# Altium schematic sheet top.SchDoc
size 420 x 297 mm; SheetNumber: 1; SheetTotal: 1
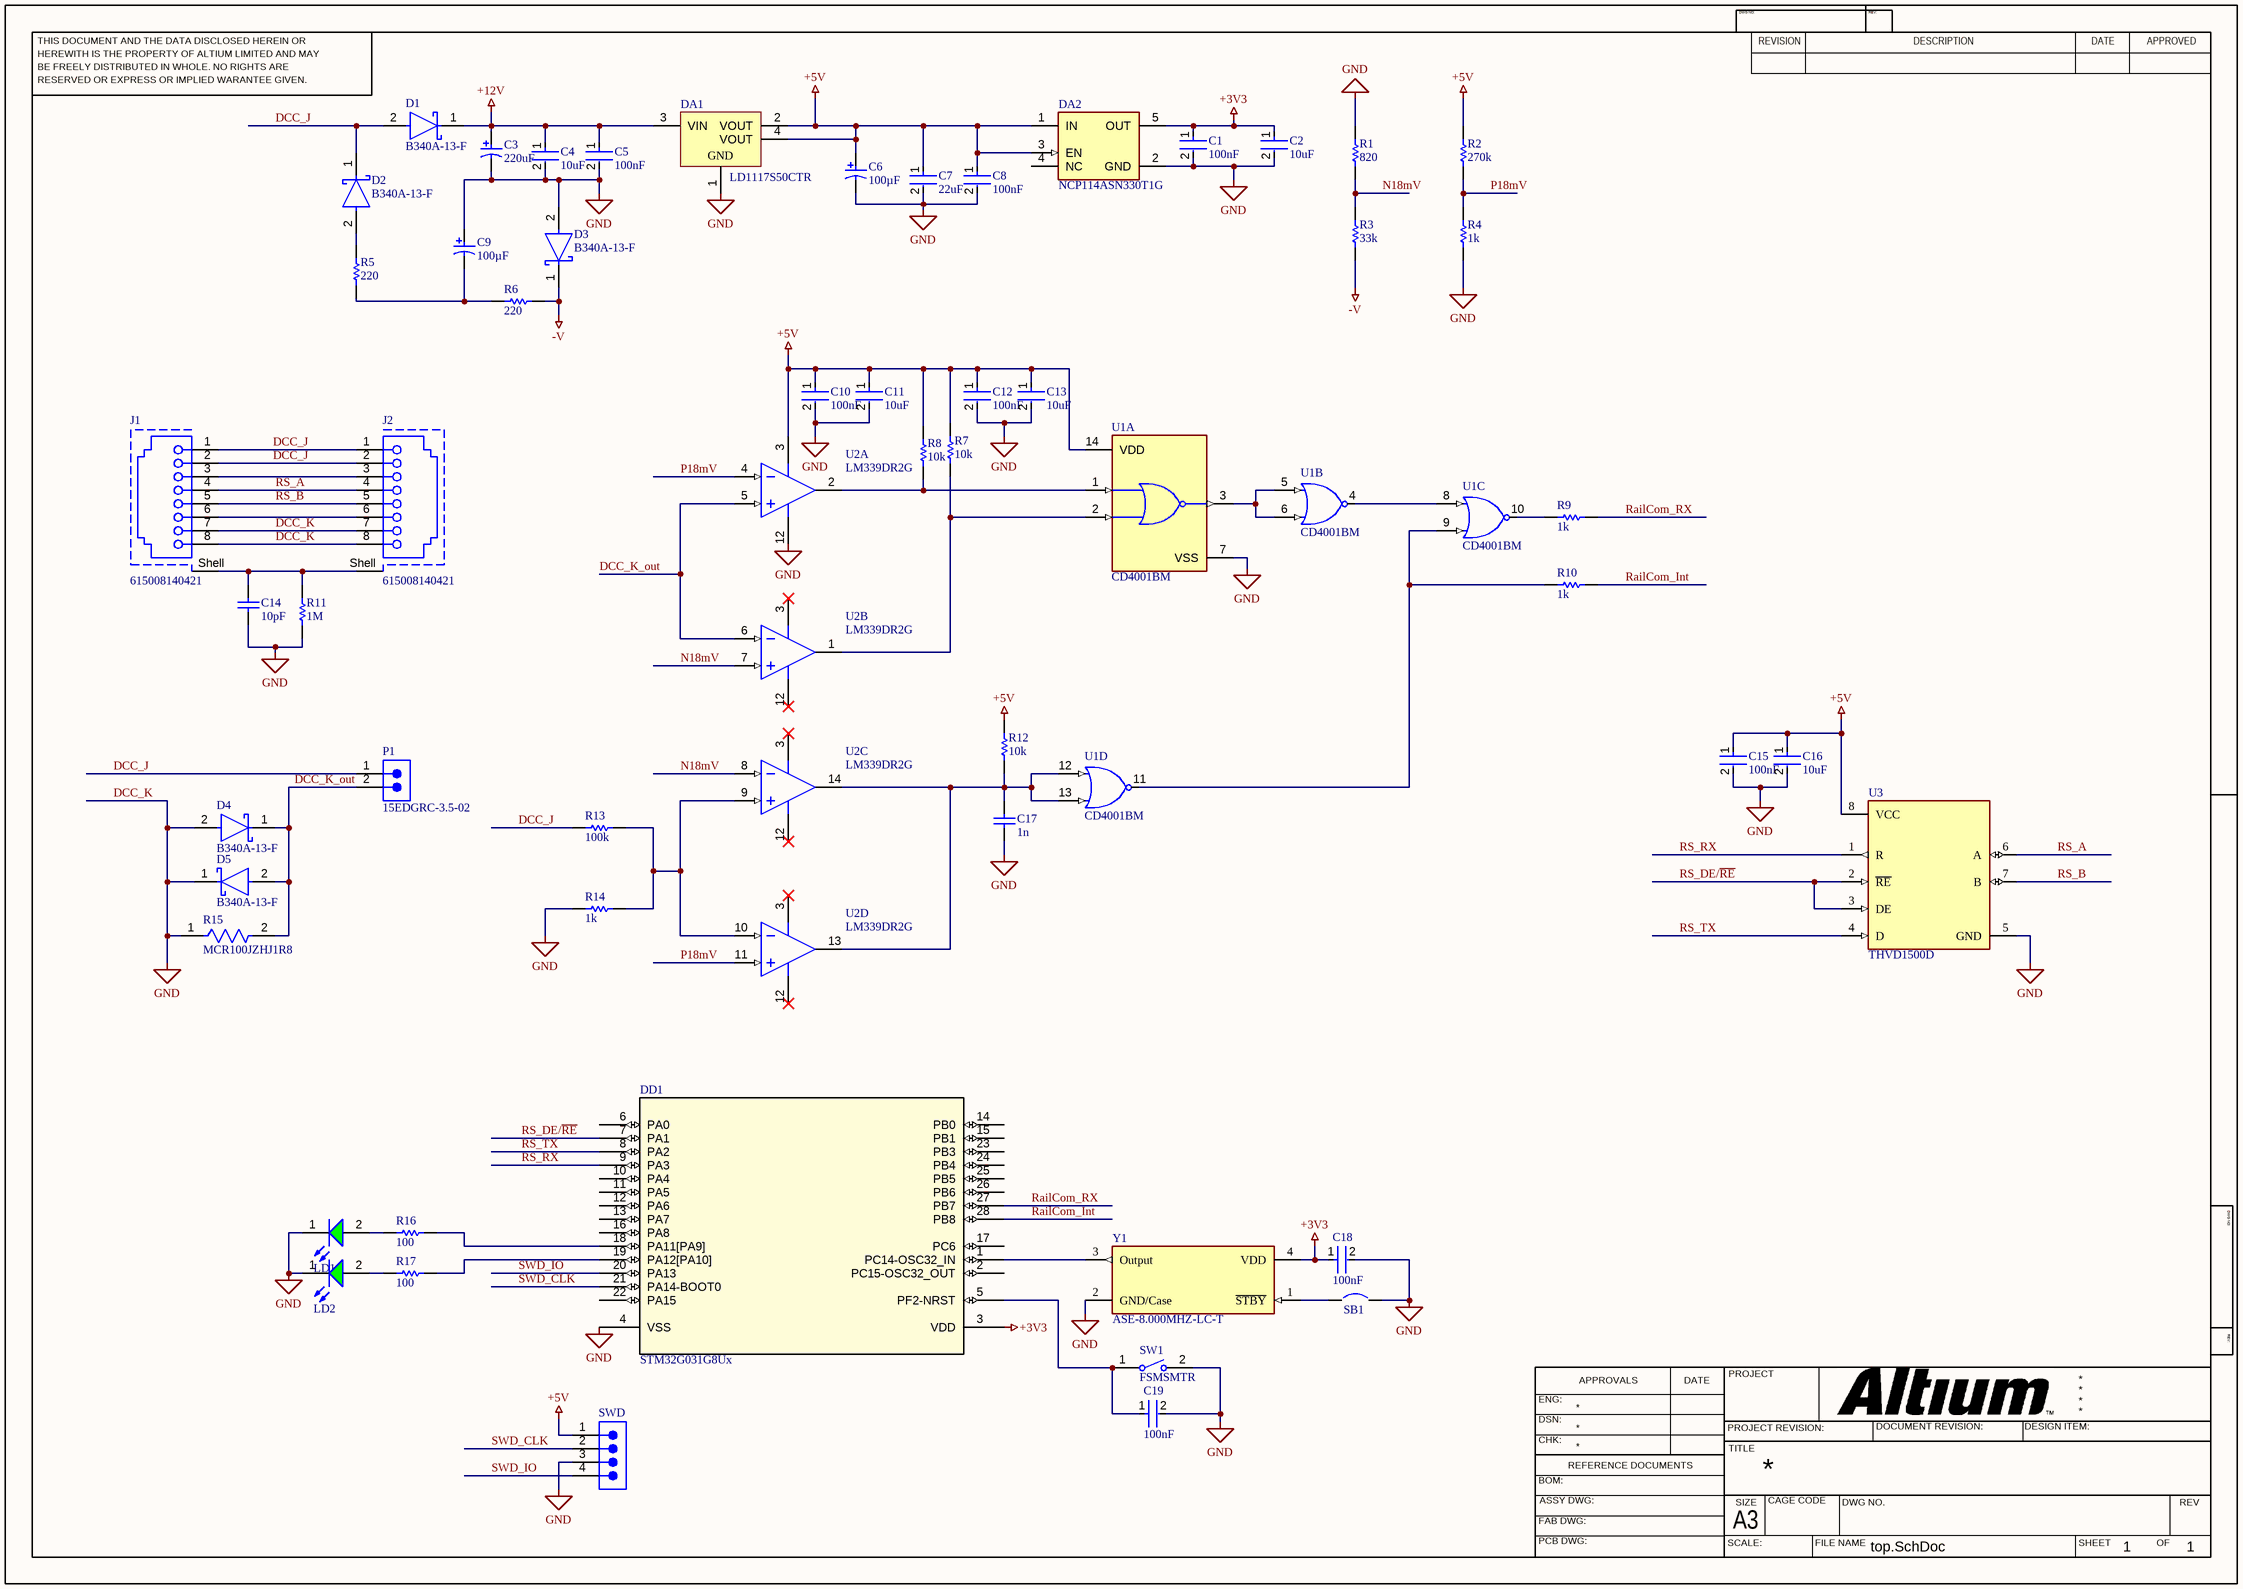
[diagram p0: top.SchDoc]

## Parts
C1  Capacitance: 100nF  [FP-CGA3E-0_3-0_1-IPC_C]  (hidden comment: CGA3E2X7R1H104K080AA)
C2  Capacitance: 10uF  [FP-GRM188-0_1-e0_2_0_55-IPC_C]  (hidden comment: GRM188R60J106ME47D)
C3  value 220uF  [PNSC-EEE-FK1E221P_N]  (hidden comment: EEE-FK1E221P)
C4  Capacitance: 10uF  [FP-GRM188-0_1-e0_2_0_55-IPC_C]  (hidden comment: GRM188R60J106ME47D)
C5  Capacitance: 100nF  [FP-CGA3E-0_3-0_1-IPC_C]  (hidden comment: CGA3E2X7R1H104K080AA)
C6  Capacitance: 100µF  [PNSC-FK-V-D8_V]  (hidden comment: EEEFK1E101XP)
C7  Capacitance: 22uF  [FP-GRM188-0_2-IPC_C]  (hidden comment: GRM188R61A226ME15D)
C8  Capacitance: 100nF  [FP-CGA3E-0_3-0_1-IPC_C]  (hidden comment: CGA3E2X7R1H104K080AA)
C9  Capacitance: 100µF  [PNSC-FK-V-D8_V]  (hidden comment: EEEFK1E101XP)
C10  Capacitance: 100nF  [FP-CGA3E-0_3-0_1-IPC_C]  (hidden comment: CGA3E2X7R1H104K080AA)
C11  Capacitance: 10uF  [FP-GRM188-0_1-e0_2_0_55-IPC_C]  (hidden comment: GRM188R60J106ME47D)
C12  Capacitance: 100nF  [FP-CGA3E-0_3-0_1-IPC_C]  (hidden comment: CGA3E2X7R1H104K080AA)
C13  Capacitance: 10uF  [FP-GRM188-0_1-e0_2_0_55-IPC_C]  (hidden comment: GRM188R60J106ME47D)
C14  value 10pF  [CAPC0603(1608)100_N]  (hidden comment: CAP 10pF 25V 0603(1608))
C15  Capacitance: 100nF  [FP-CGA3E-0_3-0_1-IPC_C]  (hidden comment: CGA3E2X7R1H104K080AA)
C16  Capacitance: 10uF  [FP-GRM188-0_1-e0_2_0_55-IPC_C]  (hidden comment: GRM188R60J106ME47D)
C17  value 1n  [CAPC1608X90X35NL10T15]  (hidden comment: GRM188R71H102KA01D)
C18  Capacitance: 100nF  [FP-CGA3E-0_3-0_1-IPC_C]  (hidden comment: CGA3E2X7R1H104K080AA)
C19  Capacitance: 100nF  [FP-CGA3E-0_3-0_1-IPC_C]  (hidden comment: CGA3E2X7R1H104K080AA)
D1  B340A-13-F  [FP-SMA-MFG]
D2  B340A-13-F  [FP-SMA-MFG]
D3  B340A-13-F  [FP-SMA-MFG]
D4  B340A-13-F  [FP-SMA-MFG]
D5  B340A-13-F  [FP-SMA-MFG]
DA1  LD1117S50CTR  [SOT-223_N]
DA2  NCP114ASN330T1G  [FP-483-MFG]
DD1  STM32G031G8Ux  [UFQFPN-28]
J1  615008140421  [615008140421]
J2  615008140421  [615008140421]
LD1  150060VS75000  [WL-SMCW_0603_150060xx75000]  (value not drawn)
LD2  150060VS75000  [WL-SMCW_0603_150060xx75000]  (value not drawn)
P1  15EDGRC-3.5-02  [691305140002]
R1  value 820  [RESC1608X55X30ML15T15]  (hidden comment: ERJ3EKF8203V)
R2  value 270k  [RESC0603X26X15LL03T05]  (hidden comment: ERJ1GNF2703C)
R3  value 33k  [RESC1608X55X30ML20T20]  (hidden comment: ERA3AEB333V)
R4  value 1k  [RESC1608X55X30NL15T15]  (hidden comment: ERJ-3EKF1001V)
R5  value 220  [RESC1608X55X30NL15T15]  (hidden comment: ERJ-3EKF2200V)
R6  value 220  [RESC1608X55X30NL15T15]  (hidden comment: ERJ-3EKF2200V)
R7  value 10k  [RESC1609X55X30NL15T15]  (hidden comment: ERJ3EKF1002V)
R8  value 10k  [RESC1609X55X30NL15T15]  (hidden comment: ERJ3EKF1002V)
R9  value 1k  [RESC1608X55X30NL15T15]  (hidden comment: ERJ-3EKF1001V)
R10  value 1k  [RESC1608X55X30NL15T15]  (hidden comment: ERJ-3EKF1001V)
R11  value 1M  [RESC1608X55X25LL10T15]  (hidden comment: RC0603FR-071ML)
R12  value 10k  [RESC1609X55X30NL15T15]  (hidden comment: ERJ3EKF1002V)
R13  value 100k  [RESC1608X55X30ML15T15]  (hidden comment: ERJ-3EKF1003V)
R14  value 1k  [RESC1608X55X30NL15T15]  (hidden comment: ERJ-3EKF1001V)
R15  MCR100JZHJ1R8  [FP-MCR100-IPC_C]
R16  value 100  [RESC1608X55X30NL15T15]  (hidden comment: ERJ-3EKF1003V)
R17  value 100  [RESC1608X55X30NL15T15]  (hidden comment: ERJ-3EKF1003V)
SB1  (no value)  [JP_SMD]
SW1  FSMSMTR  [TECO-FSMSMTR_V]
SWD  61300411121  [61300411121]  (value not drawn)
U1  CD4001BM  [FP-D0014A-MFG]  (parts A,B,C,D of 4)
U2  LM339DR2G  [ONSC-SOIC-14-751A-03_V]  (parts A,B,C,D of 4)
U3  THVD1500D  [FP-D0008B-IPC_A]
Y1  ASE-8.000MHZ-LC-T  [FP-ASE-MFG]

## Nets
+3V3: C1.1 C2.1 C18.1 DA2.5(OUT) DD1.3(VDD) Y1.4(VDD)
+5V: C6.1 C7.1 C8.1 C10.1 C11.1 C12.1 C13.1 C15.1 C16.1 DA1.2(VOUT) DA1.4(VOUT) DA2.1(IN) DA2.3(EN) R2.2 R7.1 R8.1 R12.1 SWD.1 U1.14(VDD) U2.3(VCC) U3.8(VCC)
+12V: C3.1 C4.1 C5.1 D1.1(C) DA1.3(VIN)
-V: D3.1(C) R3.1 R6.2
DCC_K: C1.2 C2.2 C3.2 C4.2 C5.2 C6.2 C7.2 C8.2 C9.1 C10.2 C11.2 C12.2 C13.2 C14.2 C15.2 C16.2 C17.1 C18.2 C19.2 D3.2(A) D4.2(A) D5.1(C) DA1.1(GND) DA2.2(GND) DD1.4(VSS) J1.7 J1.8 J2.7 J2.8 LD1.1(K) LD2.1(K) R1.2 R4.1 R11.2 R14.2 R15.1 SB1.2 SW1.2 SWD.3 U1.7(VSS) U2.12(GND) U3.5(GND) Y1.2(GND/Case)  [also labelled GND]
DCC_J: D1.2(A) D2.1(C) J1.1 J1.2 J2.1 J2.2 P1.1 R13.2
DCC_K_out: D4.1(C) D5.2(A) P1.2 R15.2 U2.5(IN1+) U2.6(IN2-)
N18mV: R1.1 R3.2 U2.7(IN2+) U2.8(IN3-)
P18mV: R2.1 R4.2 U2.4(IN1-) U2.11(IN4+)
RailCom_Int: DD1.28(PB8) R10.1
RailCom_RX: DD1.27(PB7) R9.1
RS_A: J1.4 J2.4 U3.6(A)
RS_B: J1.5 J2.5 U3.7(B)
RS_DE/~{RE}: DD1.7(PA1) U3.2(~{RE}) U3.3(DE)
RS_RX: DD1.9(PA3) U3.1(R)
RS_TX: DD1.8(PA2) U3.4(D)
SWD_CLK: DD1.21(PA14-BOOT0) SWD.2
SWD_IO: DD1.20(PA13) SWD.4
NetC9_2: C9.2 R5.1 R6.1
NetC14_1: C14.1 J1.Shell J2.Shell R11.1
NetC17_2: C17.2 R12.2 U1.12(G) U1.13(H) U2.13(OUT4) U2.14(OUT3)
NetC19_1: C19.1 DD1.5(PF2-NRST) SW1.1
NetD2_2: D2.2(A) R5.2
NetDD1_1: DD1.1(PC14-OSC32_IN) Y1.3(Output)
NetDD1_18: DD1.18(PA11[PA9]) R16.1
NetDD1_19: DD1.19(PA12[PA10]) R17.1
NetJ1_3: J1.3 J2.3
NetJ1_6: J1.6 J2.6
NetLD1_2: LD1.2(A) R16.2
NetLD2_2: LD2.2(A) R17.2
NetR7_2: R7.2 U1.2(B) U2.1(OUT2)
NetR8_2: R8.2 U1.1(A) U2.2(OUT1)
NetR9_2: R9.2 U1.10(L)
NetR10_2: R10.2 U1.9(F) U1.11(M)
NetR13_1: R13.1 R14.1 U2.9(IN3+) U2.10(IN4-)
NetSB1_1: SB1.1 Y1.1(~{STBY})
NetU1_3: U1.3(J) U1.5(C) U1.6(D)
NetU1_4: U1.4(K) U1.8(E)

Not connected (* = marked no-connect by the designer): DA2 4(NC); DD1 2(PC15-OSC32_OUT) 6(PA0) 10(PA4) 11(PA5) 12(PA6) 13(PA7) 14(PB0) 15(PB1) 16(PA8) 17(PC6) 22(PA15) 23(PB3) 24(PB4) 25(PB5) 26(PB6)

## Notes on the sheet
- THIS DOCUMENT AND THE DATA DISCLOSED HEREIN OR
- HEREWITH IS THE PROPERTY OF ALTIUM LIMITED AND MAY
- DWG NO:
- REVISION
- REV:
- DESCRIPTION
- DATE
- APPROVED
- BE FREELY DISTRIBUTED IN WHOLE. NO RIGHTS ARE
- RESERVED OR EXPRESS OR IMPLIED WARANTEE GIVEN.
- ENG:
- APPROVALS
- PROJECT
- DSN:
- CHK:
- REFERENCE DOCUMENTS
- PROJECT REVISION:
- TITLE
- DOCUMENT REVISION:
- DESIGN ITEM:
- BOM:
- FAB DWG:
- PCB DWG:
- ASSY DWG:
- SCALE:
- A3
- SIZE
- CAGE CODE
- FILE NAME
- DWG NO.
- SHEET
- OF
- REV

## Library data of the parts
C1 C5 C8 C10 C12 C15 C18 C19 = CMP-2000-07546-2: Cap Ceramic 100nF 50V X7R 10% Pad SMD 0603 +125°C Automotive T/R; Weight: 7.1E-05oz; Composition: Ceramic; Max Operating Temperature: 125°C; Termination: SMD/SMT; Dielectric: X7R; Length: 1.6mm; Package Quantity: 1; REACH SVHC: No SVHC; Lead Free: Lead Free; Case Code (Metric): 1608; Min Operating Temperature: -55°C; Packaging: Tape and Reel; Tolerance: 10%; Voltage Rating: 50V; Case Code (Imperial): 0603; Case/Package: 0603; Voltage Rating (DC): 50V; Depth: 0.8mm; Radiation Hardening: No; Ratings: AEC-Q200; Mount: Surface Mount; Voltage: 50V; Thickness: 0.035inch; Width: 0.8mm; Height: 0.8mm
C2 C4 C11 C13 C16 = CMP-2006-02792-2: Chip Multilayer Ceramic Capacitors for General Purpose, 0603, 10uF, X5R, 15%, 20%, 6.3V; Packaging: Tape and Reel; Voltage Rating (DC): 6.3V; Width: 0.031inch; Termination: SMD/SMT; Dielectric: X5R; Package Quantity: 4000; Voltage Rating: 6.3V; Case/Package: 0603; Min Operating Temperature: -55°C; Voltage: 6.3V; Length: 1.6mm; Thickness: 0.035inch; Lead Free: Lead Free; Depth: 0.8mm; Case Code (Imperial): 0603; Max Operating Temperature: 85°C; Material: Ceramic; Height: 0.8mm; Tolerance: 20%; Mount: Surface Mount; REACH SVHC: No SVHC; Radiation Hardening: No; Case Code (Metric): 1608
C3 = CMP-1665-00017-3: Aluminum Electrolytic Capacitor, 220 uF, +/- 20%, 25 V, -55 to 105 degC, 2-Pin CAPAE, RoHS, Tape and Reel; Manufacturer: Panasonic; Voltage Rating: 25 V; ComponentLink2URL: http://industrial.panasonic.com/cdbs/www-data/pdf/RDE0000/ABA0000C1181.pdf; Height: 10.2 mm; Max Operating Temperature: 105 degC; PackageReference: EEE-FK1E221P; ComponentLink1Description: Manufacturer URL; ComponentLink1URL: http://www.panasonic.com/; Mount: Surface Mount; REACH SVHC: No SVHC; Min Operating Temperature: -55 degC; ComponentLink2Description: Datasheet; DatasheetVersion: 03/2016; Length: 10.2 mm; RoHSCompliant: true; Packaging: Tape and Reel; Package Quantity: 500; Lead Pitch: 3.1 mm; Pins: 2; PackageDescription: 2-Pin Electrolytic Aluminum Capacitor, Body 8.3 x 8.3 mm; Mounting Technology: Surface Mount
C6 C9 = CMP-2000-06206-1: Aluminum Electrolytic Capacitor, 100 uF, +/- 20%, 25 V, 2-Pin SMD (Size Code D8), -55 to 105 degC, RoHS, Tape and Reel; Manufacturer: Panasonic; Type: Can; Lifetime@Temperature: 2000Hrs@105°C; Rated Voltage: 25V; Ripple Current: 280mA; Impedance: 0.34O; Case Size/Dimension: Ø6.3x7.7mm; Operating Temp-Max: 105°C; Series: FK; Package URL: http://industrial.panasonic.com/cdbs/www-data/pdf/RDE0000/DME0000COL48.pdf; Mounting Technology: SurfaceMount; Package Description: 2-Pin Electrolytic Aluminum Capacitor, Body 6.6 x 6.6 mm; Datasheet Version: 03/2016; Datasheet URL: http://industrial.panasonic.com/cdbs/www-data/pdf/RDE0000/ABA0000C1181.pdf; Manufacturer URL: http://www.panasonic.com/; Package Reference: FK-V-D8; Operating Temp Range: -55to+105°C
C7 = CMP-2000-06337-3: Chip Multilayer Ceramic Capacitors for General Purpose, 0603, 22uF, X5R, 15%, 20%, 10V; Tolerance: 20%; Weight: 0.000222oz; Material: Ceramic; Depth: 0.8mm; Length: 1.6mm; Termination: SMD/SMT; Packaging: Tape and Reel; Width: 0.8mm; Voltage Rating: 10V; Case Code (Imperial): 0603; Mount: Surface Mount; Voltage Rating (DC): 10V; Case/Package: 0603; Thickness: 0.039inch; REACH SVHC: No SVHC; Dielectric: X5R; Height: 0.8mm; Package Quantity: 4000; Case Code (Metric): 1608; Min Operating Temperature: -55°C; Lead Free: Lead Free; Max Operating Temperature: 85°C
C14 = CMP-1035-00549-1: CAP 10pF 25V ±1% 0603 (1608 Metric) Thickness 1mm SMD; Case-EIA: 0603; Case-Metric: 1608; Tolerance: Â±1%; Technology: SMT; Max Thickness: 1 mm; Rated Voltage: 25 V
C17 = CMP-2006-02891-1: Manufacturer: Murata; Part Number: GRM188R71H102KA01D
D1-D5 = CMP-1667-00003-3: DIODE SCHOTTKY 40V 3A SMA; Max Forward Surge Current (Ifsm): 80A; Forward Voltage: 500mV; Polarity: Standard; Max Reverse Current: 500uA; Capacitance: 250pF; Element Configuration: Single; Mount: Surface Mount; Output Current: 3A; Radiation Hardening: No; Width: 2.92mm; Current Rating: 3A; Termination: SMD/SMT; Voltage: 40V; Series: -; Max Operating Temperature: 125°C; Current: 3A; Max Repetitive Reverse Voltage (Vrrm): 40V; Min Operating Temperature: -55°C; REACH SVHC: No SVHC; Number of Pins: 2; Average Rectified Current: 3A; Contact Plating: Tin; RoHS Compliant: Yes; Max Reverse Voltage (DC): 40V; Packaging: Tape and Reel; Height: 2.3mm; Length: 4.6mm; Case/Package: SMA; Weight: 0.002258oz; Peak Non-Repetitive Surge Current: 80A; Package Quantity: 5000; Lead Free: Lead Free; Forward Current: 3A; Voltage Rating (DC): 40V
DA1 = CMP-0244-00311-1: Fixed Low Drop Positive Voltage Regulator, 5V, 4-Pin SOT-223, Tape and Reel; PackageReference: SOT-223; PackageVersion: 2010; ComponentLink2URL: http://www.st.com/internet/com/TECHNICAL_RESOURCES/TECHNICAL_LITERATURE/DATASHEET/CD00000544.pdf; ComponentLink1URL: http://www.st.com; ComponentLink2Description: Datasheet; DatasheetVersion: 1/11/2011; ComponentLink1Description: Manufacturer URL; PackageDescription: 4-Pin SOT-223 Package, 6.5 x 3.5 mm Body, 2.3 mm Pitch, 7 mm Lead Span
DA2 = CMP-07128-000001-1: IC REG LINEAR 3.3V 300MA 5TSOP; Manufacturer: ON Semiconductor; Dropout Voltage: 150mV; Number Of Outputs: 1; Output Type: Fixed; Standoff Height: 0.01mm; Nominal Supply Current: 50uA; Accuracy Percentage: 1%; Max Junction Temp: +150°C; Min Supply Voltage: 1.7V; Max Supply Voltage: 5.5V; Output Voltage: 3.3V; Device Class L2: Power Management ICs; Digikey Description: IC REG LINEAR 3.3V 300MA 5TSOP; Footprint Url: https://www.onsemi.com/pub/Collateral/483.PDF; Temperature: to +150°C; RoHS: TRUE; Octopart: https://octopart.com/ncp114asn330t1g-on+semiconductor-74628742; Package: 483; Height: 1.1mm; Device Class L1: Integrated Circuits (ICs); Device Class L3: Voltage Regulators - Linear; ComponentLink2URL: https://www.onsemi.com/pub/Collateral/NCP114-D.PDF; Output Current: 300mA; Automotive: No; ComponentLink2Description: Datasheet; Manufacturer Part Number: NCP114ASN330T1G; Category: IC; Lead Free: Yes; Temperature Range High: +150°C
DD1 = STM32G031G8Ux: The STM32G031x4/x6/x8 mainstream microcontrollers are based on high-performance Arm® Cortex®-M0+ 32-bit RISC core operating at up to 64 MHz frequency. / 64 Kbytes of Flash program memory and 8 Kbytes of SRAM. With 28pin UFQFPN 4x4x0.55 package; Manufacturer_Part_Number: stm32g0_ufqfpn28_t1; Built_By: EMA_Jessica; Vendor: STMicroelectronics; Copyright: Copyright (C) 2016 Accelerated Designs. All rights reserved; RefDes: RefDes; Type: DEV; Value: Value
J1 J2 = CMP-1502-01733-2: NexarPartId: 18818182; Number of Contacts: 8; Voltage Rating (AC): 120V; Current Rating: 1.5A; Gender: Female; Shielding: Shielded; Insulation Resistance: 500MΩ; Number of Ports: 1; Direction: User Selectable; Contact Resistance: 20mΩ; Connector Type: RJ45, Socket; Flammability Rating: UL94 V-0; Orientation: Vertical; Height: 16.65mm; Contact Material: Copper; Width: 19.5mm; Mount: Through Hole; Operating Supply Voltage: 120V; Color: Black; Insulation Material: PBT; Lead Free: Lead Free; Length: 16.65mm; Max Operating Temperature: 85°C; Number of Positions: 8; RoHS: Compliant; Contact Plating: Gold; Number of Rows: 1; REACH SVHC: Unknown; Min Operating Temperature: -40°C; Termination: Through Hole; Housing Material: PBT; Depth: 16.4mm; Voltage Rating: 120V
LD1 LD2 = CMP-1426-00006-7: WURTH ELEKTRONIK - 150060VS75000 - LED, Green, SMD, 0603, 30 mA, 2 V, 570 nm; Reverse Voltage: 5V; Power Dissipation: 72mW; Dominant Wavelength: 570nm; Peak Wavelength: 572nm; Forward Current: 100mA; Forward Voltage: 2V; Lens Style: Clear, Rectangular; Test Current: 20mA; Max Junction Temperature (Tj): 95°C; Viewing Angle: 140°; Luminous Intensity: 40mcd; Height: 700µm; Width: 800µm; Length: 1.6mm; Mount: Surface Mount; Min Operating Temperature: -40°C; Max Reverse Voltage (DC): 5V; Case Code (Imperial): 0603; Wavelength: 570nm; Color: Green; REACH SVHC: Unknown; RoHS: Compliant; Max Operating Temperature: 85°C; Packaging: Tape and Reel; Case/Package: 0603; Number of Pins: 2; Case Code (Metric): 1608
P1 = CMP-1502-01775-2: NexarPartId: 78871375; Gender: Male; Number of Pins: 2; Packaging: Box; RoHS: Non-Compliant; Lead Pitch: 3.5mm
R1 = CMP-2000-00657-1: Manufacturer: Panasonic; Part Number: ERJ3EKF8203V
R2 = CMP-2004-03497-1: Manufacturer: Panasonic; Part Number: ERJ1GNF2703C
R3 = CMP-2000-00041-1: Manufacturer: Panasonic; Part Number: ERA3AEB333V
R4 R9 R10 R14 = CMP-2000-00180-1: Manufacturer: Panasonic; Part Number: ERJ-3EKF1001V
R5 R6 = CMP-2000-00335-2: Chip Resistor, 220 Ohm, +/- 1%, 0.1 W, -55 to 155 degC, 0603 (1608 Metric), RoHS, Tape and Reel; Voltage Rating: 50 V; Resistance: 22 Ohm; Power Rating: 100 mW; Case\Package: 0603; ComponentLink2Description: Datasheet; PackageDescription: 2-Pin Surface Mount Device, Body 1.6 x 0.85 mm; PackageReference: 0603; ComponentLink1Description: Manufacturer URL; ComponentLink2URL: http://industrial.panasonic.com/cdbs/www-data/pdf/RDA0000/AOA0000C86.pdf; Height: 0.45 mm; Mount: Surface Mount; Case Code (Metric): 1608; Pins: 2; Width: 0.8 mm; Length: 1.6 mm; Package Quantity: 5000; Tolerance: 1%; ComponentLink1URL: http://www.panasonic.com/; Max Operating Temperature: 155 degC; Min Operating Temperature: -55 degC; RoHSCompliant: true; Packaging: Tape and Reel; Case Code (Imperial): 0603; DatasheetVersion: Apr-15; REACH SVHC: No SVHC; Voltage Rating (DC): 50 V
R7 R8 R12 = CMP-1012-00623-3: Chip Resistor, 10 KOhm, +/- 1%, 0.1 W, -55 to 155 degC, 0603 (1608 Metric), RoHS, Tape and Reel; Manufacturer: Panasonic; Voltage Rating: 75V; Case\/Package: 0603; Power Rating: 100mW; Resistance: 10KOhm; Temperature Coefficient: 100ppm\/degreesC; Number of Pins: 2; Package Reference: 603; Depth: 0.8mm; Mount: SurfaceMount; Package Description: 2-Pin Surface Mount Device, Body 1.6 x 0.85 mm; Datasheet Version: 02/2017; Length: 1.6mm; Lead Free: LeadFree; Height: 0.45mm; Number of Terminations: 2; Max Power Dissipation: 100mW; Min Operating Temperature: -55degC; Datasheet URL: https://industrial.panasonic.com/cdbs/www-data/pdf/RDA0000/AOA0000C304.pdf; Termination: SMD/SMT; Case Code (Metric): 1608; Case Code (Imperial): 0603; Tolerance: 1%; Max Operating Temperature: 155degC; RoHSCompliant: true; Voltage Rating (DC): 75V; Radiation Hardening: No; Packaging: TapeandReel; Composition: ThickFilm; Mounting Technology: SurfaceMount; Manufacturer URL: http://www.panasonic.com/; Width: 0.031inch; REACH SVHC: NoSVHC; Contact Plating: Tin; Military Standard: Not; Package Quantity: 1
R11 = CMP-1659-00056-1: Chip Resistor, 1 MOhm, +/- 1%, 100 mW, -55 to 155 degC, 0603 (1608 Metric), RoHS, Tape and Reel; Voltage Rating (DC): 25 V; Tolerance: 20%; Case\Package: Radial; Capacitance: 1 mF; Min Operating Temperature: -40 degC; PackageDescription: 2-Pin Surface Mount Device, Body 1.6 x 0.8 mm; ComponentLink1Description: Manufacturer URL; Radiation Hardening: No; DatasheetVersion: Rev. 4, 02/2016; REACH SVHC: No SVHC; Length: 20 mm; Max Operating Temperature: 85 degC; Diameter: 10 mm; Packaging: Bulk; Package Quantity: 200; PackageReference: 0603; Mount: Through Hole; ComponentLink1URL: http://www.yageo.com/; ComponentLink2URL: http://www.yageo.com/documents/recent/PYu-RC_Group_51_RoHS_L_04.pdf; ComponentLink2Description: Datasheet; Width: 0 inch; Lead Pitch: 5 mm; RoHSCompliant: true; Voltage Rating: 25 V; Height: 20 mm
R13 R16 R17 = CMP-2000-00182-1: Manufacturer: Panasonic; Part Number: ERJ-3EKF1003V
R15 = CMP-08839-000552-1: Thick Film Chip Resistor, 2512, 1.8Ω, 5%, +850/+150ppm/°C, 1W, 200V; Resistance: 1.8R; Temperature Coefficient: 850ppm/°C; Min Operating Temperature: -55°C; Max Power Dissipation: 1W; Power Rating: 1W; Case Code (Imperial): 2512; Case/Package: 2512; Height: 0.55mm; Number of Terminations: 2; Features: Automotive AEC-Q200; Max Operating Temperature: 125°C; Series: MCR; Case Code (Metric): 6432; RoHS Compliant: Yes; Width: 3.2mm; Tolerance: 5%; Length: 6.3mm; Packaging: Tape and Reel; Voltage Rating (DC): 200V
SB1 = Circuit Breaker: Solder: NO; Published: 24-Mar-1999; Revision: July-2002: Re-released for DXP Platform.; Publisher: Altium Limited
SW1 = CMP-2000-07501-1: FSMSM Push Button Switch, 50 mA, -35 to 85 degC, 2-Pin SMD, RoHS, Tape and Reel; Manufacturer: TE Connectivity; Voltage Rating (DC): 24V; Electrical Life: 20000Cycles; Operating Force: 180gf; Switch Travel: 0.25mm; Contact Current Rating: 50mA; Case\/Package: SMD/SMT; Actuator Length: 1.07mm; Throw Configuration: SPST; Actuator Material: Polyamide; Contact Resistance: 100mOhm; Illumination Type: Illuminated; Max Voltage Rating (DC): 12V; Manufacturer URL: http://www.te.com/; Lead Free: LeadFree; Packaging: TapeandReel; Min Operating Temperature: -35degC; Mechanical Life: 20000Cycles; Mount: SurfaceMount; REACH SVHC: Unknown; Package Quantity: 1800; Package Reference: FSMSMTR; RoHSCompliant: true; Max Operating Temperature: 85degC; Orientation: Straight; ELV: Compliant; Datasheet URL: http://www.te.com/commerce/DocumentDelivery/DDEController?Action=showdoc&DocId=Customer+Drawing%7F1437566-3%7FC2%7Fpdf%7FEnglish%7FENG_CD_1437566-3_C2_1437566_3_1_c.dwg.pdf%7F1437566-4; Package Description: 2-Pin Surface Mount Device, Body 6 x 3.5 mm, Pitch 9.19 mm; Current Rating: 50mA; Contact Plating: Silver; Termination: GullWing; Datasheet Version: Rev. C2, 08/2014; Contact Material: Brass; Mounting Technology: SurfaceMount
SWD = CMP-1502-01064-3: NexarPartId: 32855522; Operating Supply Voltage: 250V; Pitch: 2.54mm; Contact Resistance: 20mΩ; Number of Positions: 4; Current Rating: 3A; Connector Type: Male Pin; Gender: Male; Contact Plating: Gold; Height: 8.89mm; Lead Pitch: 2.54mm; Lead Free: Lead Free; Contact Mating Length: 5.9944mm; Number of Rows: 1; Termination: Solder; Packaging: Bulk; REACH SVHC: Unknown; Min Operating Temperature: -40°C; RoHS: Compliant; Number of Contacts: 4; Voltage Rating: 250V; Color: Black; Max Operating Temperature: 105°C; Contact Material: Copper; Mount: Through Hole; Orientation: Vertical; Number of Pins: 4
U1 = CMP-0806-00066-4: IC GATE NOR 4CH 2-INP 14SOIC; Output Current: 6.8mA; Number of Inputs: 2; Propagation Delay: 90ns; Number of Circuits: 4; Quiescent Current: 5uA; Max Supply Voltage: 18V; Schmitt Trigger Input: No; Min Supply Voltage: 3V; Number of Output Lines: 1; Low Level Output Current: 4.2mA; High Level Output Current: -4.2mA; Number of Elements: 4; Turn-On Delay Time: 90ns; Packaging: Rail/Tube; Mount: Surface Mount; Height: 1.58mm; Number of Bits: 4; Weight: 0.004564oz; Logic Function: NOR; Lead Free: Lead Free; Package Quantity: 50; Radiation Hardening: No; Length: 8.65mm; Min Operating Temperature: -55°C; Case/Package: SOIC; Number of Outputs: 1; Max Operating Temperature: 125°C; REACH SVHC: No SVHC; Contact Plating: Gold; Number of Pins: 14; Width: 3.91mm; Number of Input Lines: 2; Number of Gates: 4
U2 = CMP-1305-00036-1: Single Supply Quad Comparators, 0 to 70 degC, 14-Pin SOIC, Pb-Free, Tape and Reel; Manufacturer: On Semiconductor; IO Typ (mA): 16; ComponentLink3URL: http://www.onsemi.com/pub_link/Collateral/751A-03.PDF; RoHS: TRUE; Packing: Tape and Reel; ComponentLink2Description: Datasheet; ComponentLink2URL: http://www.onsemi.com/pub_link/Collateral/LM339-D.PDF; ComponentLink1Description: Manufacturer URL; PackageVersion: Rev. K, 05/2011; DatasheetVersion: Rev. 20; PackageReference: SOIC-14-751A-03; ComponentLink1URL: http://www.onsemi.com/; PartNumber: LM339DR2G; PackageDescription: 14-Pin Small Outline Integrated Circuit, Body 8.65 x 3.9 mm, Pitch 1.27 mm; ComponentLink3Description: Package Specification; Mounting Technology: Surface Mount
U3 = CMP-04875-000034-1: IC TRANSCEIVER HALF 1/1 8SOIC; Output Current per Channel: 75mA; Input Offset Voltage (Vos): 200uV; Number of Circuits: 1; Operating Supply Current: 1.6mA; Data Rate: 300Kbps; Receiver Hysteresis: 50mV; Slew Rate: 10V/µs; Simplex/Duplex: Half Duplex; Gain Bandwidth Product: 10MHz; Input Bias Current: 8pA; Case/Package: VSSOP; Max Operating Temperature: 125°C; Mount: Surface Mount; Min Operating Temperature: -40°C; Packaging: Tape and Reel; RoHS Compliant: Yes
Y1 = CMP-27762-006944-1: XTAL Oscillator 8MHz ±50ppm CMOS 3.3V 4-SMD 3.2mm x 2.5mm; Max Supply Current: 7mA; Max Supply Voltage: 3.465V; Min Supply Voltage: 3.135V; Load Capacitance: 15pF; Length: 3.2mm; REACH SVHC: No SVHC; Operating Supply Voltage: 3.3V; Frequency Stability: 50ppm; Height: 0.047inch; Width: 0.098inch; Number of Pins: 4; Package Quantity: 1000; Min Operating Temperature: -40°C; Operating Frequency: 8 MHz; Termination: SMD/SMT; Max Operating Temperature: 85°C; Frequency: 8MHz; Radiation Hardening: No; Depth: 2.5mm; Case/Package: SMD/SMT; Packaging: Tape and Reel; Mount: Surface Mount; Series: ASE; Lead Free: Lead Free